# EasyEDA Pro project BLDCV6-nerdyintern.eprj, schematic Schematic4
Create Date: 2024-09-27; Page Name: P1; Project Name: BLDCV6; Schematic Name: Schematic4; Update Date: 2024-09-26; Company: EasyEDA.com; Drawn: EasyEDA; Page Size: A4; Part Number: JLCPCB-002; Reviewed: EasyEDA; Version: V0.1
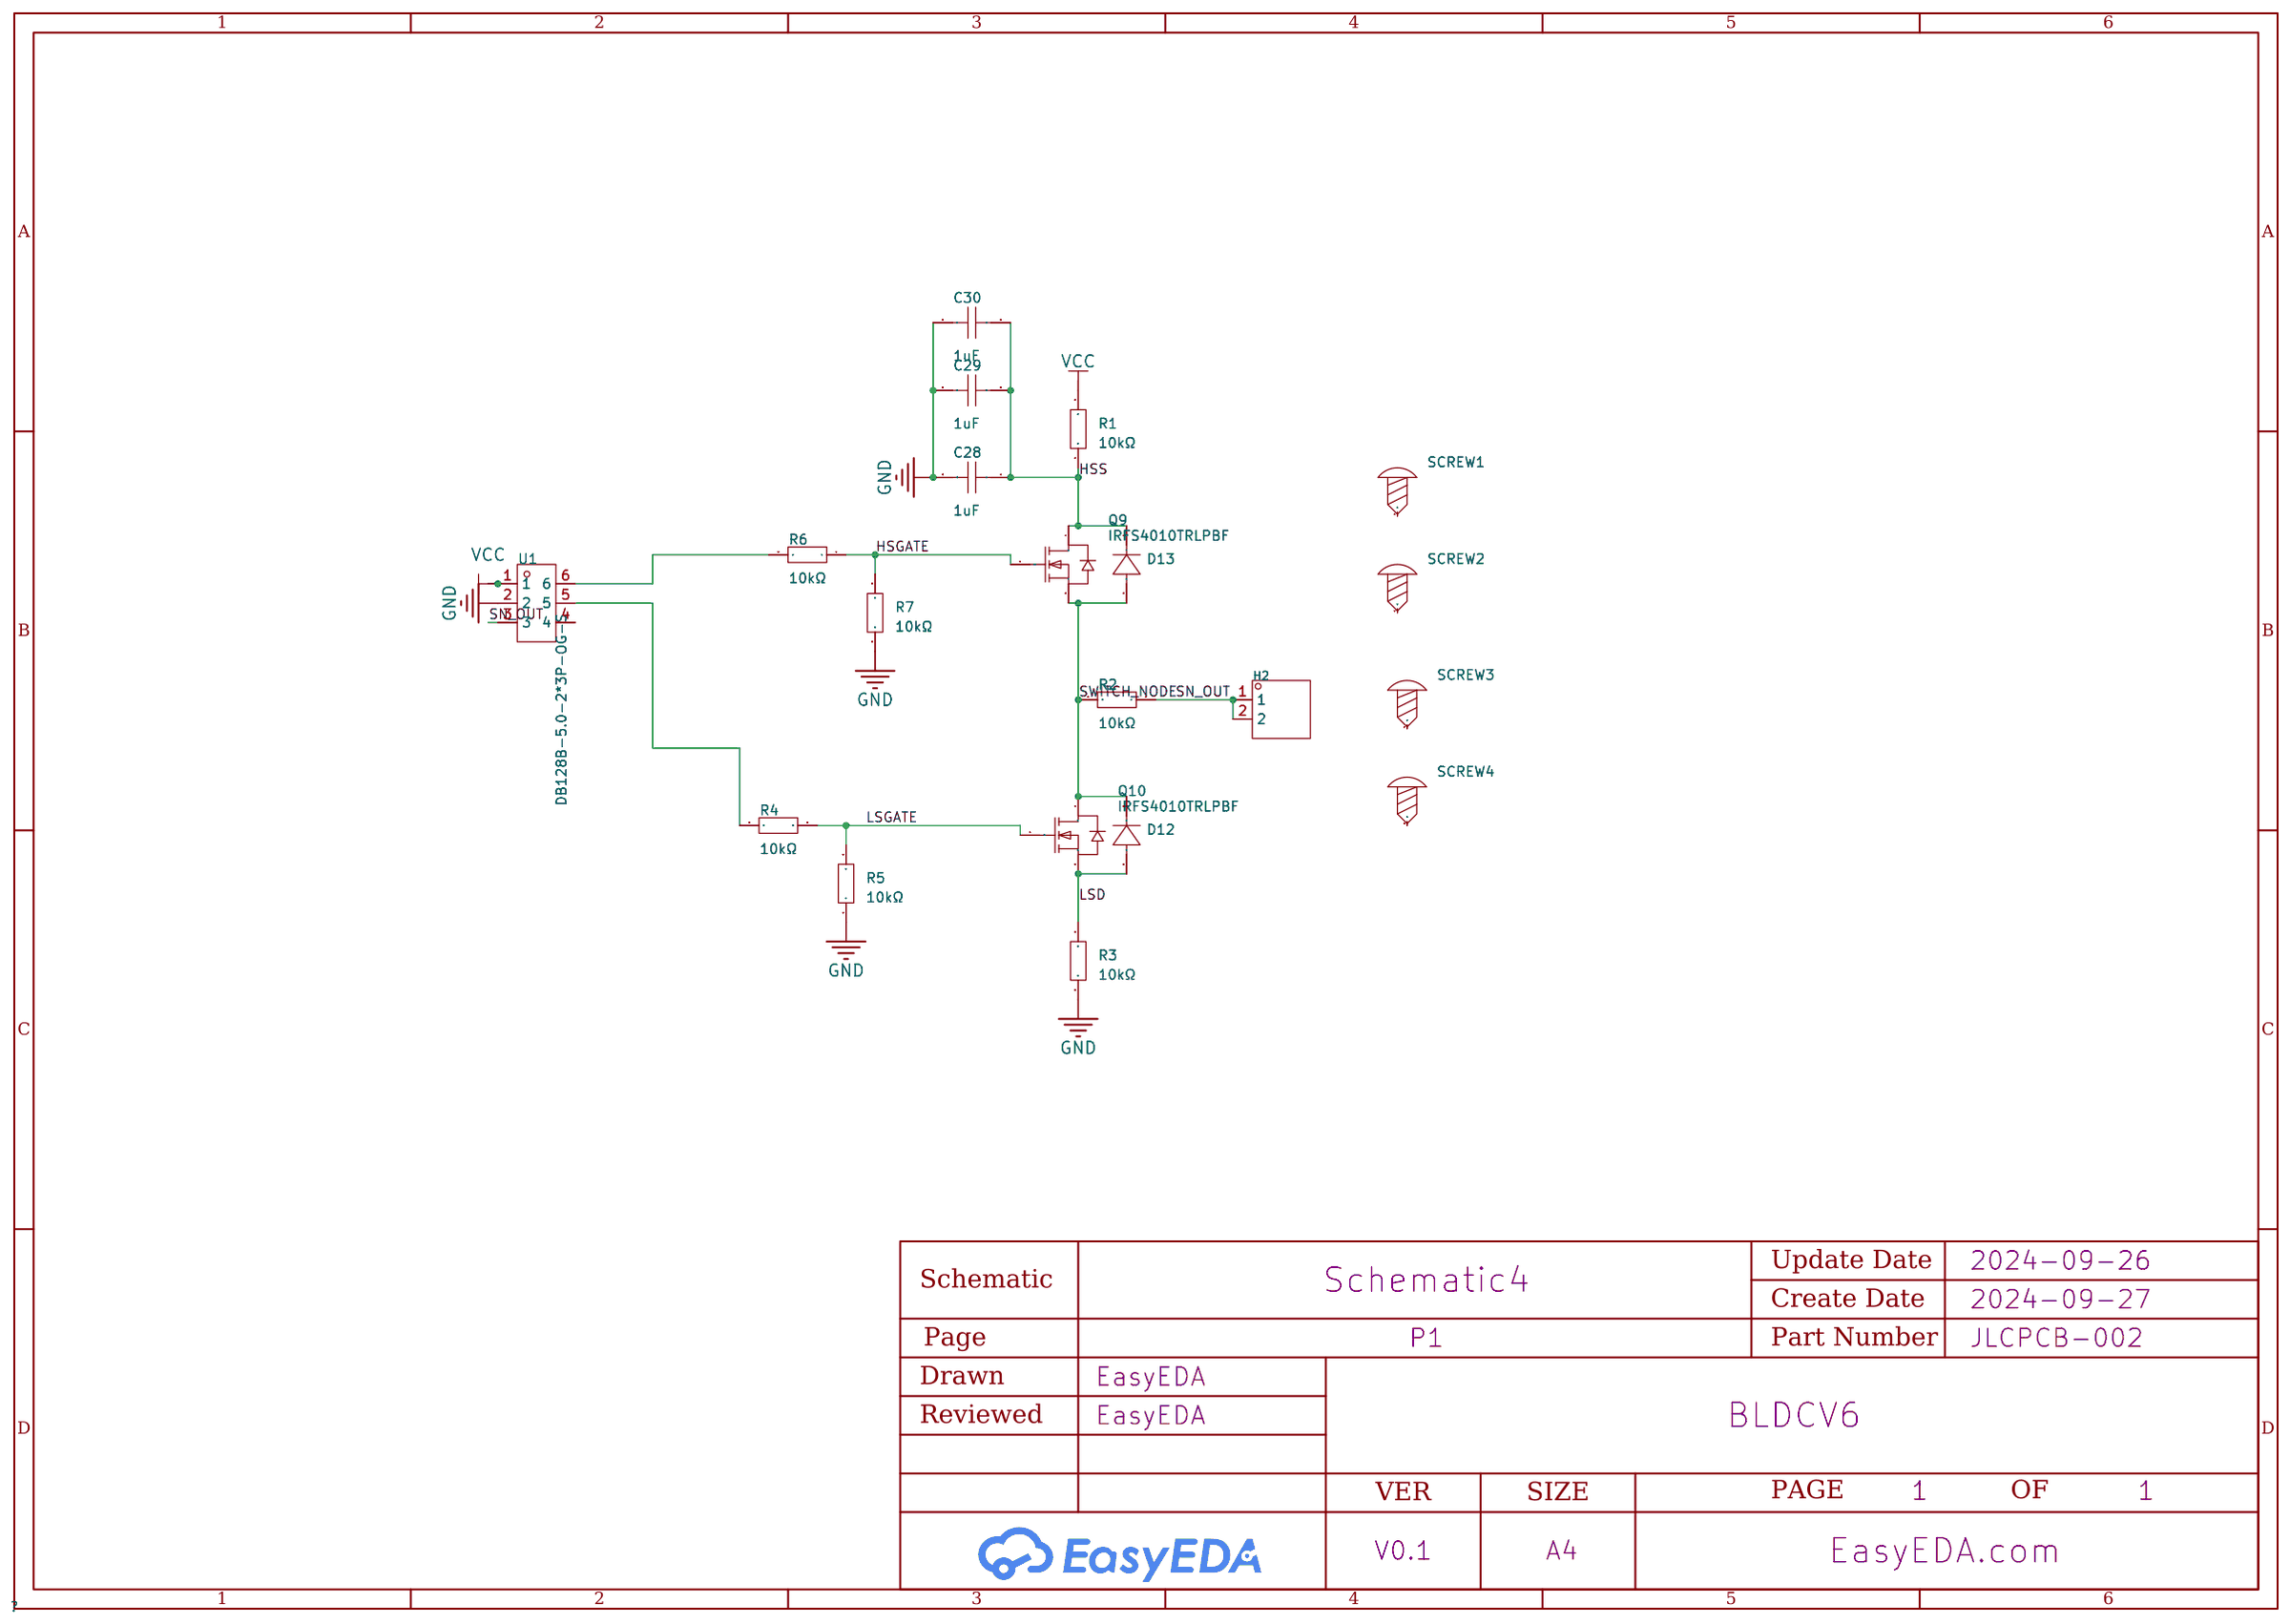
[diagram p3: schematic sheet]

## Parts
C28  1uF  [CAP-TH_L7.2-W2.5-P5.00-D0.6]
C29  1uF  [CAP-TH_L17.0-W8.5-P15.00-D0.8]
C30  1uF  [CAP-TH_L17.0-W8.5-P15.00-D0.8]
D12  -  [DO-41_BD2.4-L4.7-P8.70-D0.9-RD]
D13  -  [DO-41_BD2.4-L4.7-P8.70-D0.9-RD]
H2  -  [HDR-TH_2P-P2.54-V-M-1]
Q9  IRFS4010TRLPBF  [D2PAK_L9.1-W10.0-P2.54-LS15.3-BR-1]
Q10  IRFS4010TRLPBF  [D2PAK_L9.1-W10.0-P2.54-LS15.3-BR-1]
R1  10kΩ  [RES-TH_BD4.5-L11.5-P15.50-D0.8]
R2  10kΩ  [RES-TH_BD4.5-L11.5-P15.50-D0.8]
R3  10kΩ  [RES-TH_BD4.5-L11.5-P15.50-D0.8]
R4  10kΩ  [RES-TH_BD4.5-L11.5-P15.50-D0.8]
R5  10kΩ  [RES-TH_BD4.5-L11.5-P15.50-D0.8]
R6  10kΩ  [RES-TH_BD4.5-L11.5-P15.50-D0.8]
R7  10kΩ  [RES-TH_BD4.5-L11.5-P15.50-D0.8]
SCREW1  -  [Screw-Hole-M4]
SCREW2  -  [Screw-Hole-M4]
SCREW3  -  [Screw-Hole-M4]
SCREW4  -  [Screw-Hole-M4]
U1  DB128B-5.0-2*3P-OG-S  [CONN-TH_DB128B-5.0-3P-XX-S]

## Library data of the parts
C28 = SMEC334J100M2: Capacitance: Tolerance:±5% Tolerance:±5% Voltage Rated:; LCSC Part Name: 330nF ±5% 100V; Supplier Part: C401104; Manufacturer: CHAMPION(全鹏); Supplier Footprint: 插件,P=5mm; JLCPCB Part Class: Extended Part; Datasheet: https://atta.szlcsc.com/upload/public/pdf/source/20190730/C401104_3330673C3D333BC9993FC47731C2A492.pdf; Supplier: LCSC; Tolerance: ±5%
C29 C30 = CFC2J105JG1I170KE100: Capacitance: Tolerance:±5% Tolerance:±5% Voltage Rated: Operating Temperature:-40℃~+105℃ Operating Temperature:-40℃~+105℃; LCSC Part Name: 1uF ±5% 630V; Supplier Part: C19712461; Manufacturer: Dersonic(德尔创); Supplier Footprint: 插件,P=15mm; JLCPCB Part Class: Extended Part; Datasheet: https://atta.szlcsc.com/upload/public/pdf/source/20231222/863053FE409B07859E357469CFF315BC.pdf; Supplier: LCSC; Tolerance: ±5%; Operating Temperature: -40℃~+105℃
D12 D13 = 1N4007: Supplier Footprint: DO-41
H2 = HDR-M_2.54_1x2P: Supplier Footprint: Through
Q9 Q10 = IRFS4010TRLPBF: Type:1个NChannel Drain Source Voltage (Vdss): Continuous Drain Current (Id): Power Dissipation (Pd): Drain Source On Resistance (RDS(on)@Vgs,Id):4.7mΩ@106A,10V Gate Threshold Voltage (Vgs(th)@Id):4V@250uA Total Gate Charge (Qg@Vgs):215nC@10V Input Capacita; LCSC Part Name: 1个N沟道 耐压:100V 电流:180A; Supplier Part: C538014; Manufacturer: Infineon(英飞凌); Supplier Footprint: D2PAK; JLCPCB Part Class: Extended Part; Datasheet: https://atta.szlcsc.com/upload/public/pdf/source/20200522/C538014_ECAE1AD36155800A57BA846B4DCA8F0D.pdf; Supplier: LCSC; Type: 1个NChannel; Drain Source On Resistance (RDS(on)@Vgs,Id): 4.7mΩ@106A,10V; Gate Threshold Voltage (Vgs(th)@Id): 4V@250uA; Total Gate Charge (Qg@Vgs): 215nC@10V; Input Capacitance (Ciss@Vds): 9.575nF@50V; Operating Temperature: -55℃~+175℃@(Tj)
R1-R7 = Res_AXIAL-1W: Supplier Footprint: Through
SCREW1-SCREW4 = Screw-Hole-M4: Supplier Footprint: 插件
U1 = DB128B-5.0-2*3P-OG-S: Structure:2x3P Pitch:5mm Color:Orange Mounting Style:Straight Current Rating (Max):20A Voltage Rating (Max):300V Number of Pins:6P Number of Rows:2 Wire Gauge - AWG:12~28 Wire Gauge - AWG:12~28 Wire Gauge - mm2:1~2.5 Wire Gauge - mm2:1~2.5 Number of PINs; LCSC Part Name: 5mm 2x3P 排数:2 每排P数:3 直插 2件套; Supplier Part: C500028; Manufacturer: DORABO(地博电气); Supplier Footprint: 插件,P=5mm; JLCPCB Part Class: Extended Part; Datasheet: https://atta.szlcsc.com/upload/public/pdf/source/20230106/BD10F348BB66DAA415880E99FF7C427D.pdf; Supplier: LCSC; Structure: 2x3P; Pitch: 5mm; Color: Orange; Mounting Style: Straight; Current Rating (Max): 20A; Voltage Rating (Max): 300V; Number of Pins: 6P; Number of Rows: 2; Wire Gauge - AWG: 12~28; Wire Gauge - mm2: 1~2.5; Number of PINs Per Row: 3; Operating Temperature Range: -40℃~+105℃

## Nets
GND: C28.2 C29.1 C30.1 R3.2 R5.1 R7.1 U1.2
VCC: R1.2 U1.1
HSGATE: Q9.1(G) R6.1 R7.2
HSS: C28.1 C29.2 C30.2 D13.1(K) Q9.4(D) R1.1
LSD: D12.2(A) Q10.3(S) R3.1
LSGATE: Q10.1(G) R4.1 R5.2
SN_OUT: H2.1 H2.2 R2.1 U1.3
SWITCH_NODE: D12.1(K) D13.2(A) Q9.3(S) Q10.4(D) R2.2
$1N1078: R6.2 U1.6
$1N1105: R4.2 U1.5

Not connected (* = marked no-connect by the designer): SCREW1 1; SCREW2 1; SCREW3 1; SCREW4 1; U1 4
